# Altium project Neon-Demon-earing-revA.PrjPcb
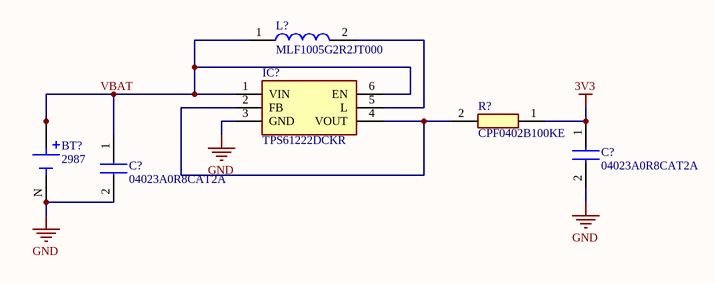
[diagram p0: Neon-Demon-Earing-revA.SchDoc]
1 sheet, 6 parts. Net scope: global (net labels, ports and power ports of the same name join across sheets).
Board file: Neon-Demon-Earing-revA.PcbDoc

## Sheet Neon-Demon-Earing-revA.SchDoc
size A4; SheetNumber: 1; SheetTotal: 1

### Parts
(Parts that share a designator on the sheet are numbered #1, #2 ... from top to bottom, then left to right.)
BT?  2987  [BAT_2987]
C?#1  04023A0R8CAT2A  [CAPC1005X56N]
C?#2  04023A0R8CAT2A  [CAPC1005X56N]
IC?  TPS61222DCKR  [SOT65P210X110-6N]
L?  MLF1005G2R2JT000  [INDC1005X55N]
R?  CPF0402B100KE  [RESC1005X35N]

### Nets
3V3: C?#1.1 R?.1
GND: BT?.N(NEG) C?#1.2 C?#2.2 IC?.3(GND)
VBAT: BT?.P1(POS) BT?.P2(POS) C?#2.1 IC?.1(VIN) IC?.6(EN) L?.1
NetIC?_2: IC?.2(FB) IC?.4(VOUT) R?.2
NetIC?_5: IC?.5(L) L?.2

### Library data of the parts
C?#1 C?#2 = 04023A0R8CAT2A: Capacitor; Manufacturer_Name: AVX; Datasheet Link: http://www.mouser.com/catalog/supplier/library/pdf/AVXSurfaceMountCeramic.pdf; Height: 0.56mm; Manufacturer_Part_Number: 04023A0R8CAT2A; Mouser Part Number: 581-04023A0R8CAT2A; Mouser Price/Stock: https://www.mouser.co.uk/ProductDetail/AVX/04023A0R8CAT2A?qs=ZwvTZoB9SO%252BVBOZ%252BNMbjzw%3D%3D
IC? = TPS61222DCKR: Integrated Circuit; Manufacturer_Name: Texas Instruments; Datasheet Link: https://www.ti.com/lit/gpn/TPS61222; Height: 1.1mm; Manufacturer_Part_Number: TPS61222DCKR; Mouser Part Number: 595-TPS61222DCKR; Mouser Price/Stock: https://www.mouser.co.uk/ProductDetail/Texas-Instruments/TPS61222DCKR?qs=IDSsxkoac0xpx0kmXXJcTA%3D%3D; Arrow Part Number: TPS61222DCKR; Arrow Price/Stock: https://www.arrow.com/en/products/tps61222dckr/texas-instruments?region=nac
L? = MLF1005G2R2JT000: Inductor; Manufacturer_Name: TDK-Lambda; Datasheet Link: https://product.tdk.com/system/files/dam/doc/product/inductor/inductor/smd/catalog/inductor_commercial_standard_mlf1005_en.pdf; Height: 0.55mm; Manufacturer_Part_Number: MLF1005G2R2JT000; Mouser Part Number: 810-MLF1005G2R2JT000; Mouser Price/Stock: https://www.mouser.co.uk/ProductDetail/TDK/MLF1005G2R2JT000?qs=%2FPzWLGNeQ%252BhXmsvIBrs2gg%3D%3D
R? = CPF0402B100KE: Resistor; Manufacturer_Name: TE Connectivity; Datasheet Link: http://www.farnell.com/datasheets/1786775.pdf; Height: 0.35mm; Manufacturer_Part_Number: CPF0402B100KE; Mouser Part Number: 279-CPF0402B100KE; Mouser Price/Stock: https://www.mouser.co.uk/ProductDetail/TE-Connectivity-Holsworthy/CPF0402B100KE?qs=CXI0wBT1M2h4W2Gm72yIGA%3D%3D; Arrow Part Number: CPF0402B100KE; Arrow Price/Stock: https://www.arrow.com/en/products/cpf0402b100ke/te-connectivity?region=nac
BT? = 2987: Package: None; Price: None; Value: *; MP: 2987; Availability: Unavailable